# EAGLE schematic ece411-t4-rx-hand-controlled-robot (EAGLE 8.4.0)
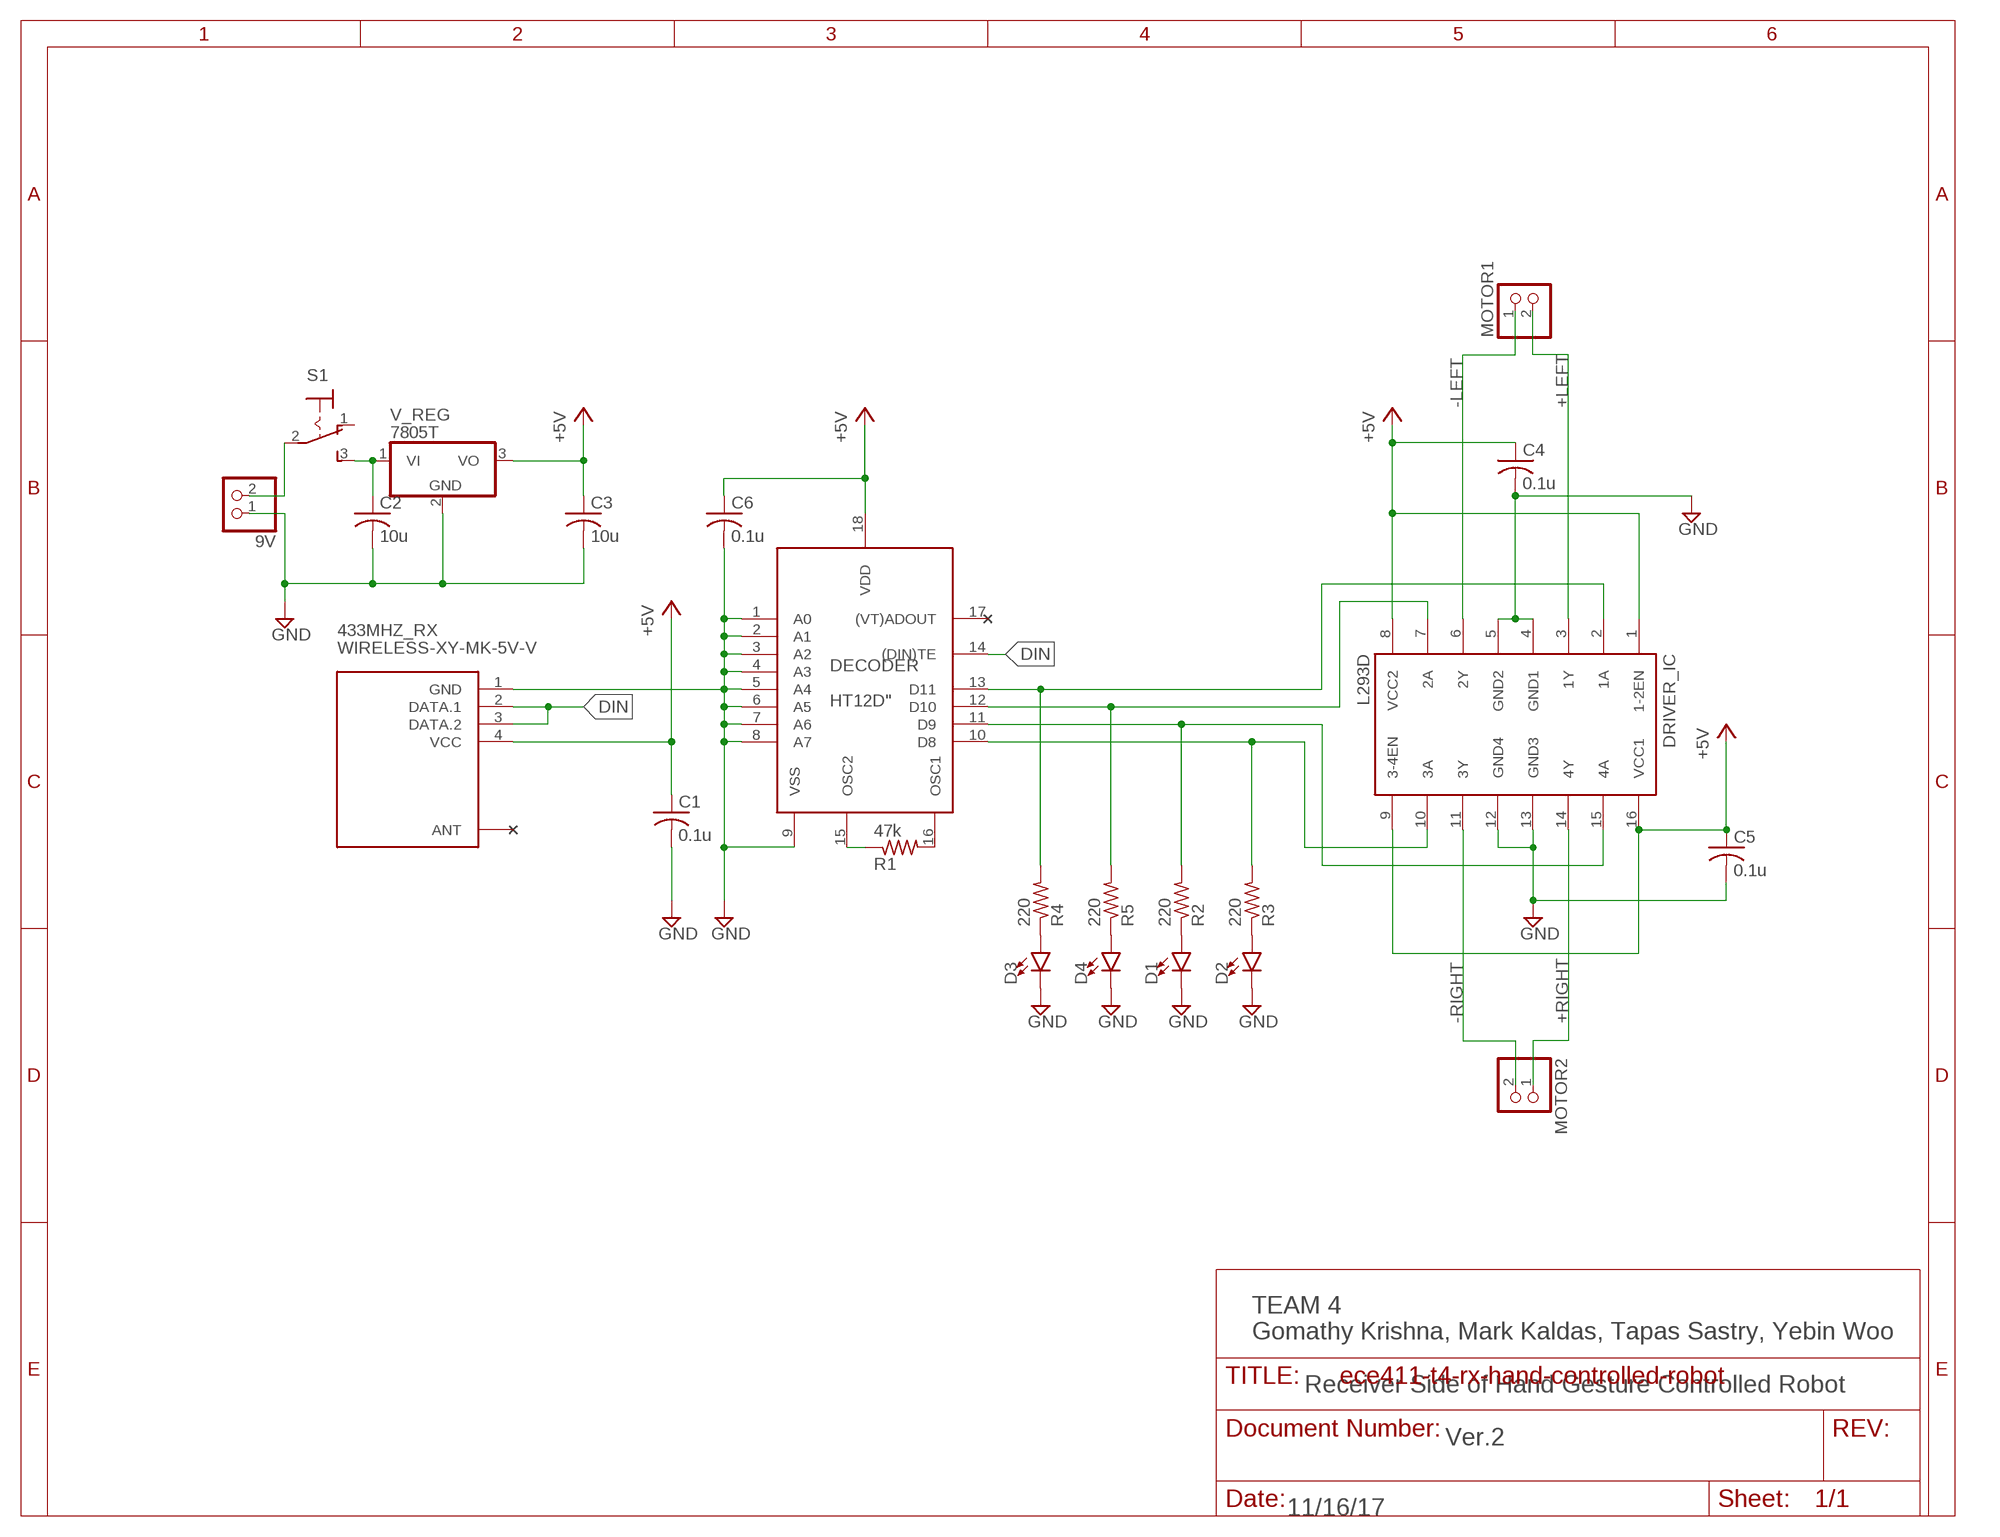
[diagram p0: schematic, sheet 1]

## Parts
9V  PINHD-1X2  [1X02]
433MHZ_RX  WIRELESS-XY-MK-5V-V  [WIRELESS-XY-MK-5V#V]
C1  0.1u  C-USC0805  [C0805]
C2  10u  C-USC0805  [C0805]
C3  10u  C-USC0805  [C0805]
C4  0.1u  C-USC0805  [C0805]
C5  0.1u  C-USC0805  [C0805]
C6  0.1u  C-USC0805  [C0805]
D1  LED3MM  [LED_3MM]
D2  LED3MM  [LED_3MM]
D3  LED3MM  [LED_3MM]
D4  LED3MM  [LED_3MM]
DECODER  HT12D"  [18-DIP-A]
DRIVER_IC  L293D  [DIL16]
MOTOR1  PINHD-1X2  [1X02]
MOTOR2  PINHD-1X2  [1X02]
R1  47k  R-US_R0805  [R0805]
R2  220  R-US_R0805  [R0805]
R3  220  R-US_R0805  [R0805]
R4  220  R-US_R0805  [R0805]
R5  220  R-US_R0805  [R0805]
S1  M9040P  [M9040P]
V_REG  7805T  [TO220H]

## Nets
+5V [+5V]: 433MHZ_RX.4(VCC) C1.1 C3.1 C4.1 C5.1 C6.1 DECODER.18(VDD) DRIVER_IC.1(1-2EN) DRIVER_IC.8(VCC2) DRIVER_IC.9(3-4EN) DRIVER_IC.16(VCC1) V_REG.3(VO)
+LEFT [Motor]: DRIVER_IC.3(1Y) MOTOR1.2
+RIGHT [Motor]: DRIVER_IC.14(4Y) MOTOR2.1
-LEFT [Motor]: DRIVER_IC.6(2Y) MOTOR1.1
-RIGHT [Motor]: DRIVER_IC.11(3Y) MOTOR2.2
DIN: 433MHZ_RX.2(DATA.1) 433MHZ_RX.3(DATA.2) DECODER.14((DIN)TE)
GND: 9V.1 433MHZ_RX.1(GND) C1.2 C2.2 C3.2 C4.2 C5.2 C6.2 D1.K(C) D2.K(C) D3.K(C) D4.K(C) DECODER.1(A0) DECODER.2(A1) DECODER.3(A2) DECODER.4(A3) DECODER.5(A4) DECODER.6(A5) DECODER.7(A6) DECODER.8(A7) DECODER.9(VSS) DRIVER_IC.4(GND1) DRIVER_IC.5(GND2) DRIVER_IC.12(GND4) DRIVER_IC.13(GND3) V_REG.2(GND)
N$1: DECODER.16(OSC1) R1.2
N$3: DECODER.10(D8) DRIVER_IC.10(3A) R3.2
N$4: DECODER.15(OSC2) R1.1
N$5: D1.A R2.1
N$6: DECODER.11(D9) DRIVER_IC.15(4A) R2.2
N$7: DECODER.12(D10) DRIVER_IC.7(2A) R5.2
N$8: DECODER.13(D11) DRIVER_IC.2(1A) R4.2
N$10: 9V.2 S1.2(P)
N$13: D2.A R3.1
N$14: D3.A R4.1
N$16: D4.A R5.1
N$17: C2.1 S1.3(S) V_REG.1(VI)
Unconnected: 433MHZ_RX.ANT DECODER.17((VT)ADOUT) S1.1(O)

## Notes on the sheet
- TEAM 4
  Gomathy Krishna, Mark Kaldas, Tapas Sastry, Yebin Woo
- Receiver Side of Hand Gesture Controlled Robot
- Ver.2
- 11/16/17

## Library data of the parts
9V MOTOR1 MOTOR2 = pinhead:PINHD-1X2: PIN HEADER
433MHZ_RX = diy-modules:WIRELESS-XY-MK-5V: RF Wireless XY-MK-5V Receiver Click here to find device on ebay.com <http://www.ebay.com/sch/xd+rf+5v-receiver> Note: Sold together with transmitter.
C1-C6 = adafruit:C-US: CAPACITOR, American symbol
D1-D4 = SparkFun-LED:LED: LED (Generic) Standard schematic elements and footprints for 5mm, 3mm, 1206, and 0603 sized LEDs. Generic LEDs with no color specified.; PROD_ID: DIO-08794
DECODER = holtek:HT12D: decoder = receiver ic
DRIVER_IC = st-microelectronics:L293D: PUSH-PULL 4 CHANNEL DRIVER; MPN: L293D; OC_FARNELL: 9589619; OC_NEWARK: 56P8249
R1-R5 = adafruit:R-US_: RESISTOR, American symbol
S1 = switch:M9040P: TOGGLE SWITCH Marquardt
V_REG = adafruit:78*: Positive VOLTAGE REGULATOR Added bigger pads to the TO-92 package

## Net classes
0 default: width 0.178 mm, drill 0.406 mm, clearance 0.203 mm
1 +5V: width 1.27 mm, drill 0.406 mm, clearance 0.203 mm to class 0, clearance 0.203 mm
2 Motor: width 1.27 mm, drill 0.406 mm, clearance 0.203 mm to class 0, clearance 0.203 mm to class 1, clearance 0.203 mm